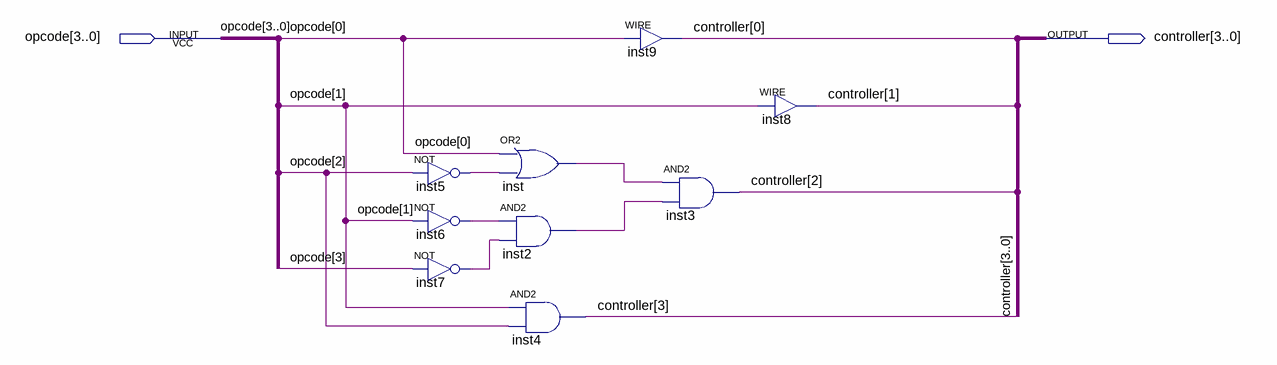
[diagram p0: schematic sheet]
// Quartus schematic ALUcontroller.bdf as structural Verilog: 9 symbols, 2 pins
module ALUcontroller (
  input  [3:0] opcode,
  output [3:0] controller
);

  wire inst2_out, inst5_out, inst6_out, inst7_out, inst_out;

  not inst5 (inst5_out, opcode[2]);
  not inst6 (inst6_out, opcode[1]);
  not inst7 (inst7_out, opcode[3]);
  or inst (inst_out, opcode[0], inst5_out);
  and inst2 (inst2_out, inst6_out, inst7_out);
  and inst4 (controller[3], opcode[1], opcode[2]);
  assign controller[0] = opcode[0];  // WIRE inst9
  and inst3 (controller[2], inst_out, inst2_out);
  assign controller[1] = opcode[1];  // WIRE inst8
endmodule
